# EAGLE schematic SMTParts_Digikey (EAGLE 9.5.1)
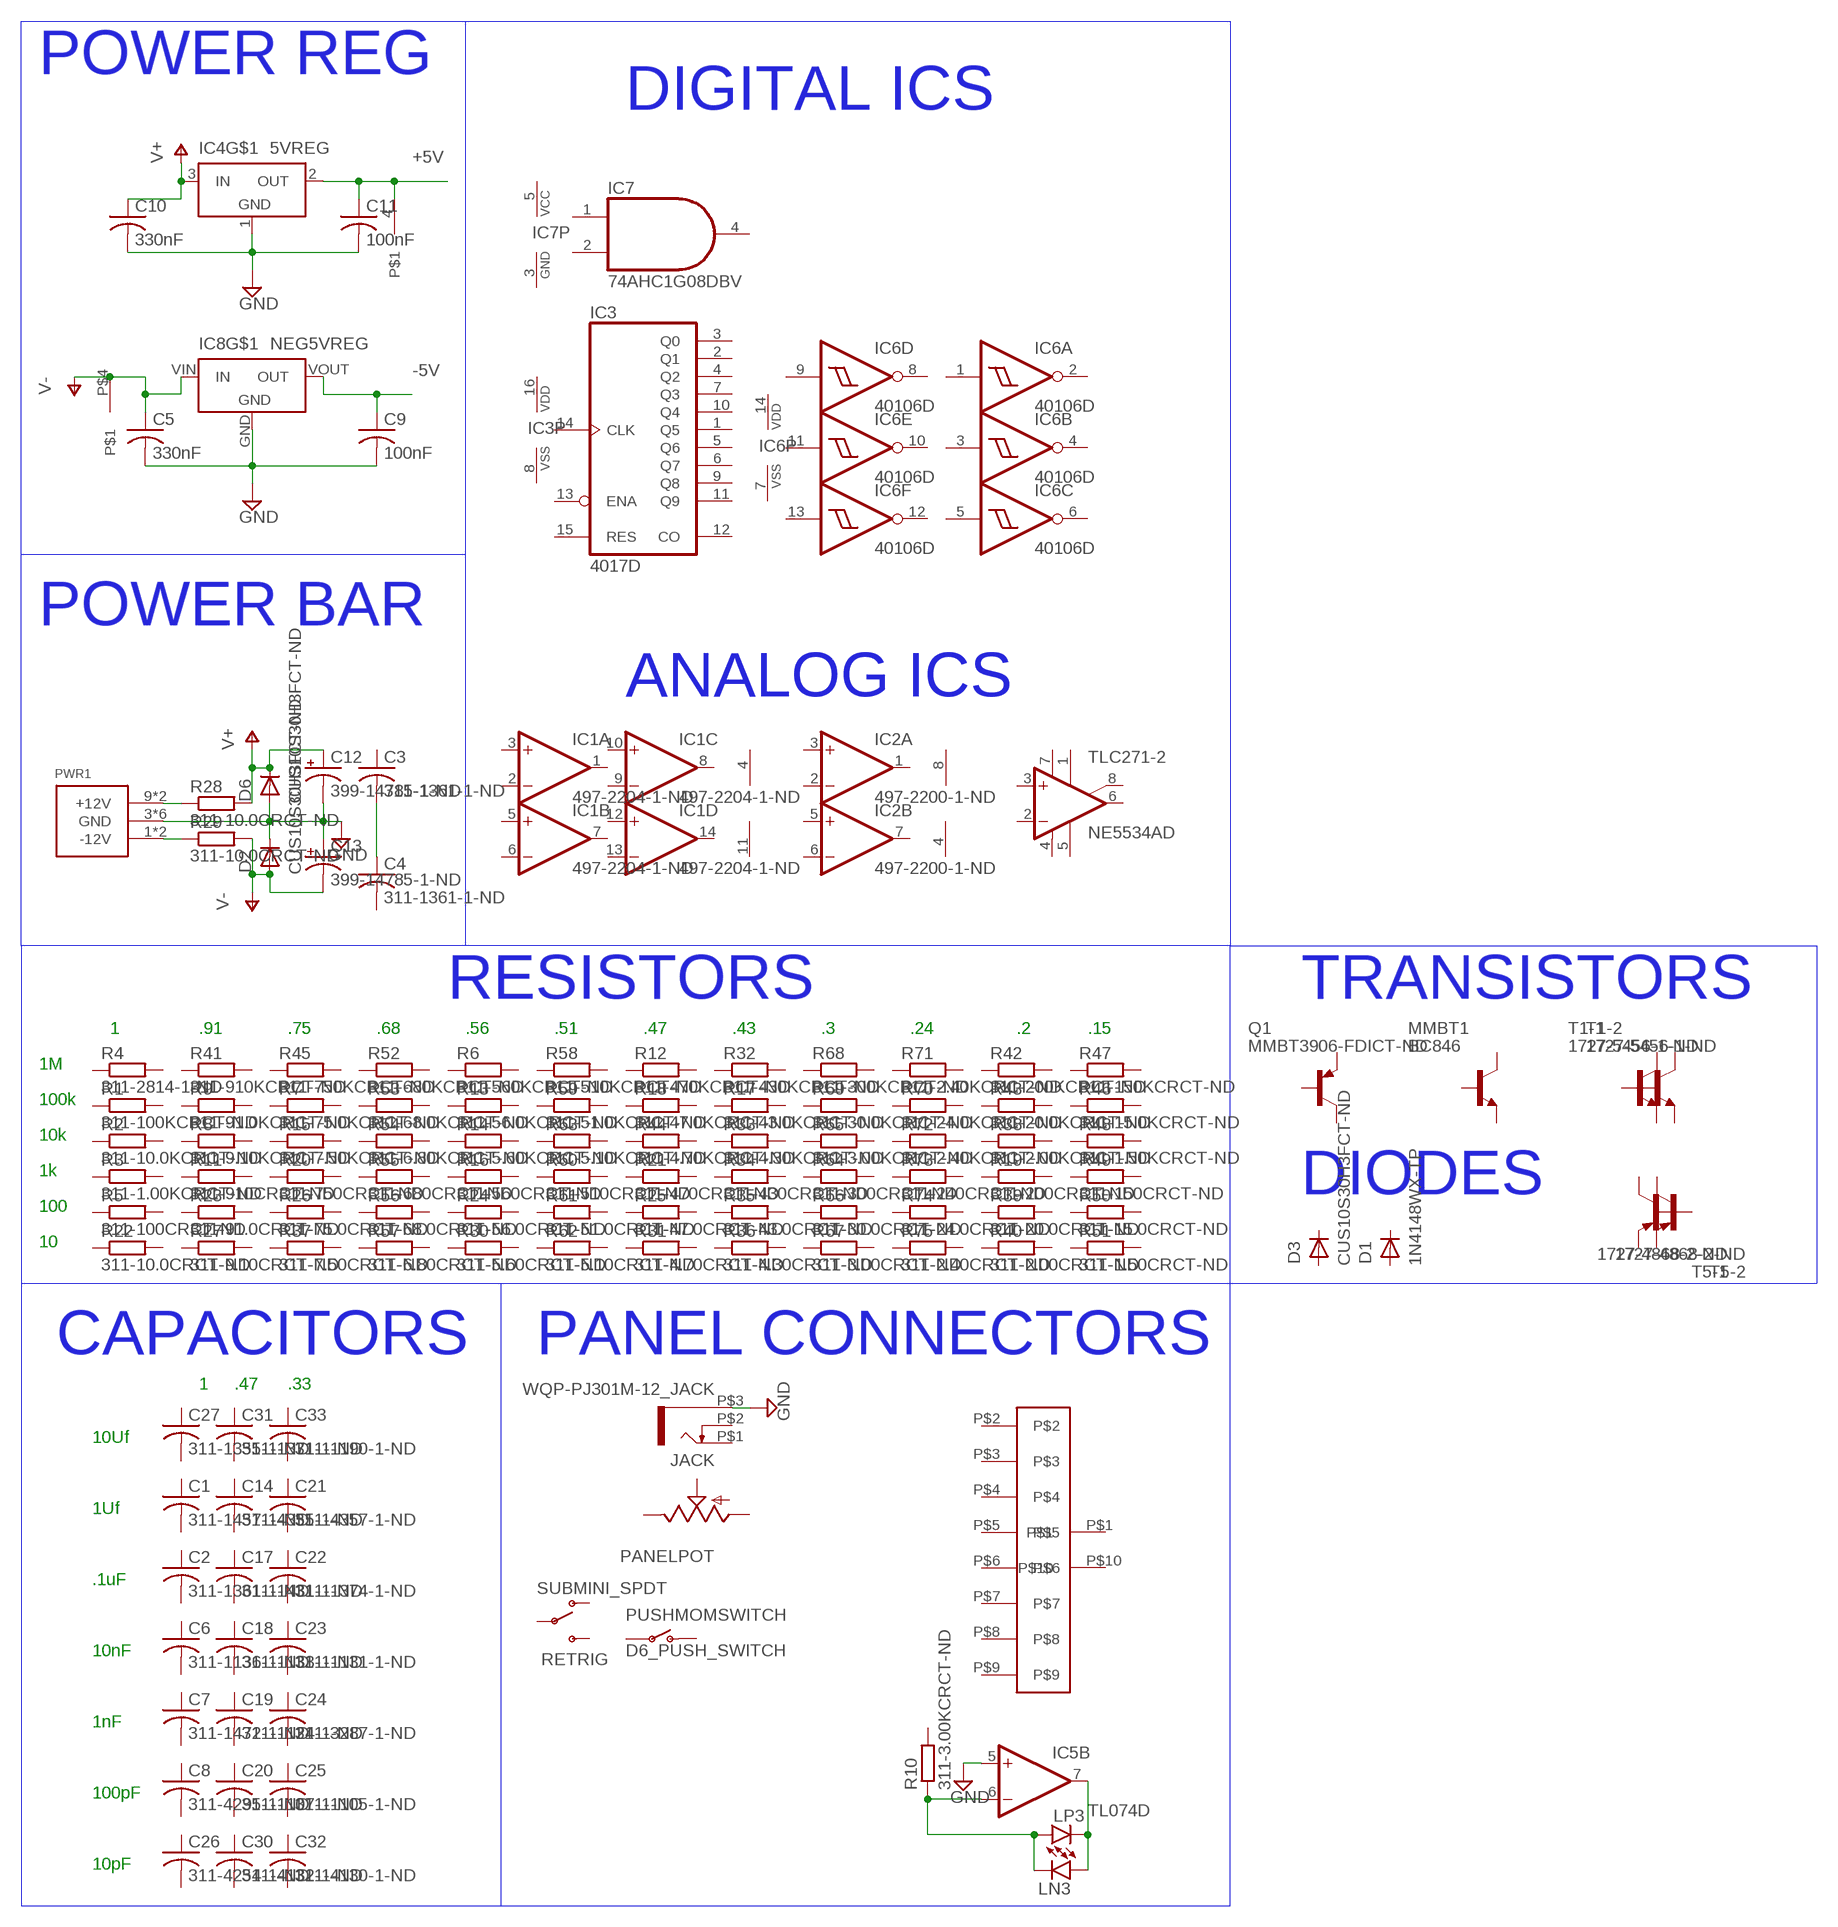
[diagram p0: schematic, sheet 1]

## Parts
C1  311-1457-1-ND  C-USC0805  [C0805]
C2  311-1361-1-ND  C-USC0805  [C0805]
C3  311-1361-1-ND  C-USC0805  [C0805]
C4  311-1361-1-ND  C-USC0805  [C0805]
C5  330nF  C-USC0805  [C0805]
C6  311-1136-1-ND  C-USC0805  [C0805]
C7  311-1472-1-ND  C-USC0805  [C0805]
C8  311-4295-1-ND  C-USC0805  [C0805]
C9  100nF  C-USC0805  [C0805]
C10  330nF  C-USC0805  [C0805]
C11  100nF  C-USC0805  [C0805]
C12  399-14785-1-ND  CPOL-USD  [PANASONIC_D]
C13  399-14785-1-ND  CPOL-USD  [PANASONIC_D]
C14  311-4355-1-ND  C-USC0805  [C0805]
C17  311-1431-1-ND  C-USC0805  [C0805]
C18  311-1133-1-ND  C-USC0805  [C0805]
C19  311-1124-1-ND  C-USC0805  [C0805]
C20  311-1107-1-ND  C-USC0805  [C0805]
C21  311-4357-1-ND  C-USC0805  [C0805]
C22  311-1374-1-ND  C-USC0805  [C0805]
C23  311-1131-1-ND  C-USC0805  [C0805]
C24  311-3287-1-ND  C-USC0805  [C0805]
C25  311-1105-1-ND  C-USC0805  [C0805]
C26  311-4254-1-ND  C-USC0805  [C0805]
C27  311-1355-1-ND  C-USC0805  [C0805]
C30  311-4132-1-ND  C-USC0805  [C0805]
C31  311-1371-1-ND  C-USC0805  [C0805]
C32  311-4130-1-ND  C-USC0805  [C0805]
C33  311-1190-1-ND  C-USC0805  [C0805]
D1  1N4148WX-TP  BAS321  [SOD323(F)]
D2  CUS10S30H3FCT-ND  BAS321  [SOD323(F)]
D3  CUS10S30H3FCT-ND  BAS321  [SOD323(F)]
D6  CUS10S30H3FCT-ND  BAS321  [SOD323(F)]
IC1  497-2204-1-ND  TL074D  [SO14]
IC2  497-2200-1-ND  TL072D  [SO08]
IC3  4017D  [SO16]
IC4  5VREG  5VREG-3.3  [SOT223]
IC5  TL074D  [SO14]
IC6  40106D  [SO14]
IC7  74AHC1G08DBV  [SOT23-5]
IC8  NEG5VREG  5VREG89SOT89  [SOT89]
JACK  WQP-PJ301M-12_JACK  [WQP-PJ301M-12_JACK]
LN3  LED3MM  [LED3MM]
LP3  LED3MM  [LED3MM]
MMBT1  BC846  [SOT23]
PANELPOT  9MM_SNAP-IN_POT_  [9MM_SNAP-IN_POT]
PUSHMOMSWITCH  D6_PUSH_SWITCH  [D6_BUTTON_RND]
PWR1  POWER_SIMPLE10  [POWER_10]
Q1  MMBT3906-FDICT-ND  MMBT3906LT1SMD  [SOT23-BEC]
R1  311-100KCRCT-ND  R-EU_M0805  [M0805]
R2  311-10.0KCRCT-ND  R-EU_M0805  [M0805]
R3  311-1.00KCRCT-ND  R-EU_M0805  [M0805]
R4  311-2814-1-ND  R-EU_M0805  [M0805]
R5  311-100CRCT-ND  R-EU_M0805  [M0805]
R6  311-560KCRCT-ND  R-EU_M0805  [M0805]
R7  311-75.0KCRCT-ND  R-EU_M0805  [M0805]
R8  311-9.10KCRCT-ND  R-EU_M0805  [M0805]
R9  311-91.0KCRCT-ND  R-EU_M0805  [M0805]
R10  311-3.00KCRCT-ND  R-EU_M0805  [M0805]
R11  311-910CRCT-ND  R-EU_M0805  [M0805]
R12  311-470KCRCT-ND  R-EU_M0805  [M0805]
R13  311-56.0KCRCT-ND  R-EU_M0805  [M0805]
R14  311-5.60KCRCT-ND  R-EU_M0805  [M0805]
R15  311-7.50KCRCT-ND  R-EU_M0805  [M0805]
R16  311-560CRCT-ND  R-EU_M0805  [M0805]
R17  311-43.0KCRCT-ND  R-EU_M0805  [M0805]
R18  311-47.0KCRCT-ND  R-EU_M0805  [M0805]
R19  311-200CRCT-ND  R-EU_M0805  [M0805]
R20  311-750CRCT-ND  R-EU_M0805  [M0805]
R21  311-470CRCT-ND  R-EU_M0805  [M0805]
R22  311-10.0CRCT-ND  R-EU_M0805  [M0805]
R23  311-91.0CRCT-ND  R-EU_M0805  [M0805]
R24  311-56.0CRCT-ND  R-EU_M0805  [M0805]
R25  311-47.0CRCT-ND  R-EU_M0805  [M0805]
R26  311-75.0CRCT-ND  R-EU_M0805  [M0805]
R27  311-9.10CRCT-ND  R-EU_M0805  [M0805]
R28  311-10.0CRCT-ND  R-EU_M0805  [M0805]
R29  311-10.0CRCT-ND  R-EU_M0805  [M0805]
R30  311-5.60CRCT-ND  R-EU_M0805  [M0805]
R31  311-4.70CRCT-ND  R-EU_M0805  [M0805]
R32  311-430KCRCT-ND  R-EU_M0805  [M0805]
R33  311-4.30KCRCT-ND  R-EU_M0805  [M0805]
R34  311-430CRCT-ND  R-EU_M0805  [M0805]
R35  311-43.0CRCT-ND  R-EU_M0805  [M0805]
R36  311-4.30CRCT-ND  R-EU_M0805  [M0805]
R37  311-7.50CRCT-ND  R-EU_M0805  [M0805]
R38  311-2.00KCRCT-ND  R-EU_M0805  [M0805]
R39  311-20.0CRCT-ND  R-EU_M0805  [M0805]
R40  311-2.00CRCT-ND  R-EU_M0805  [M0805]
R41  311-910KCRCT-ND  R-EU_M0805  [M0805]
R42  311-200KCRCT-ND  R-EU_M0805  [M0805]
R43  311-20.0KCRCT-ND  R-EU_M0805  [M0805]
R44  311-4.70KCRCT-ND  R-EU_M0805  [M0805]
R45  311-750KCRCT-ND  R-EU_M0805  [M0805]
R46  311-15.0KCRCT-ND  R-EU_M0805  [M0805]
R47  311-150KCRCT-ND  R-EU_M0805  [M0805]
R48  311-1.50KCRCT-ND  R-EU_M0805  [M0805]
R49  311-150CRCT-ND  R-EU_M0805  [M0805]
R50  311-15.0CRCT-ND  R-EU_M0805  [M0805]
R51  311-1.50CRCT-ND  R-EU_M0805  [M0805]
R52  311-680KCRCT-ND  R-EU_M0805  [M0805]
R53  311-68.0KCRCT-ND  R-EU_M0805  [M0805]
R54  311-6.80KCRCT-ND  R-EU_M0805  [M0805]
R55  311-680CRCT-ND  R-EU_M0805  [M0805]
R56  311-68.0CRCT-ND  R-EU_M0805  [M0805]
R57  311-6.80CRCT-ND  R-EU_M0805  [M0805]
R58  311-510KCRCT-ND  R-EU_M0805  [M0805]
R59  311-51.0KCRCT-ND  R-EU_M0805  [M0805]
R60  311-510CRCT-ND  R-EU_M0805  [M0805]
R61  311-51.0CRCT-ND  R-EU_M0805  [M0805]
R62  311-5.10CRCT-ND  R-EU_M0805  [M0805]
R63  311-5.10KCRCT-ND  R-EU_M0805  [M0805]
R64  311-300CRCT-ND  R-EU_M0805  [M0805]
R65  311-3.00KCRCT-ND  R-EU_M0805  [M0805]
R66  311-30.0CRCT-ND  R-EU_M0805  [M0805]
R67  311-3.00CRCT-ND  R-EU_M0805  [M0805]
R68  311-300KCRCT-ND  R-EU_M0805  [M0805]
R69  311-30.0KCRCT-ND  R-EU_M0805  [M0805]
R70  311-24.0KCRCT-ND  R-EU_M0805  [M0805]
R71  311-2.40KCRCT-ND  R-EU_M0805  [M0805]
R72  311-2.40KCRCT-ND  R-EU_M0805  [M0805]
R73  311-240CRCT-ND  R-EU_M0805  [M0805]
R74  311-24.0CRCT-ND  R-EU_M0805  [M0805]
R75  311-2.40CRCT-ND  R-EU_M0805  [M0805]
RETRIG  SUBMINI_SPDT  [SUBMINI_TOGGLE]
T1  1727-5456-1-ND  BC847BS  [SOT363]
T5  1727-4868-2-ND  BC857BS  [SOT363]
TLC271-2  NE5534AD  [SO08]
U$1  8ROTSW  [8ROTARY]

## Nets
1: C3.2 C4.1
+5V: C11.1 IC4.2(OUT) IC4.4
-5V: C9.1 IC8.VOUT(OUT)
GND: C5.2 C9.2 C10.2 C11.2 C12.- C13.+ D2.1(K) D6.2(A) IC4.1(GND) IC5.5(B:+IN) IC8.GND JACK.P$3 PWR1.3(GND) PWR1.4(GND) PWR1.5(GND) PWR1.6(GND) PWR1.7(GND) PWR1.8(GND)
N$10: IC5.6(B:-IN) LN3.K(C) LP3.A R10.1
N$22: IC5.7(B:OUT) LN3.A LP3.K(C)
N$32: PWR1.9(+12V) PWR1.10(+12V) R28.1
N$33: PWR1.1(-12V) PWR1.2(-12V) R29.1
V+ [New]: C10.1 C12.+ D6.1(K) IC4.3(IN) R28.2
V-: C5.1 C13.- D2.2(A) IC8.P$4 IC8.VIN(IN) R29.2
Unconnected: C1.1 C1.2 C2.1 C2.2 C3.1 C4.2 C6.1 C6.2 C7.1 C7.2 C8.1 C8.2 C14.1 C14.2 C17.1 C17.2 C18.1 C18.2 C19.1 C19.2 C20.1 C20.2 C21.1 C21.2 C22.1 C22.2 C23.1 C23.2 C24.1 C24.2 C25.1 C25.2 C26.1 C26.2 C27.1 C27.2 C30.1 C30.2 C31.1 C31.2 C32.1 C32.2 C33.1 C33.2 D1.1(K) D1.2(A) D3.1(K) D3.2(A) IC1.1(A:OUT) IC1.2(A:-IN) IC1.3(A:+IN) IC1.5(B:+IN) IC1.6(B:-IN) IC1.7(B:OUT) IC1.8(C:OUT) IC1.9(C:-IN) IC1.10(C:+IN) IC1.12(D:+IN) IC1.13(D:-IN) IC1.14(D:OUT) IC2.1(A:OUT) IC2.2(A:-IN) IC2.3(A:+IN) IC2.5(B:+IN) IC2.6(B:-IN) IC2.7(B:OUT) IC3.1(Q5) IC3.2(Q1) IC3.3(Q0) IC3.4(Q2) IC3.5(Q6) IC3.6(Q7) IC3.7(Q3) IC3.9(Q8) IC3.10(Q4) IC3.11(Q9) IC3.12(CO) IC3.13(ENA) IC3.14(CLK) IC3.15(RES) IC5.1(A:OUT) IC5.2(A:-IN) IC5.3(A:+IN) IC5.8(C:OUT) IC5.9(C:-IN) IC5.10(C:+IN) IC5.12(D:+IN) IC5.13(D:-IN) IC5.14(D:OUT) IC6.1(A:I) IC6.2(A:O) IC6.3(B:I) IC6.4(B:O) IC6.5(C:I) IC6.6(C:O) IC6.8(D:O) IC6.9(D:I) IC6.10(E:O) IC6.11(E:I) IC6.12(F:O) IC6.13(F:I) IC7.1(I0) IC7.2(I1) IC7.4(O) JACK.P$1 JACK.P$2 MMBT1.1(B) MMBT1.2(E) MMBT1.3(C) PANELPOT.1(A) PANELPOT.2(S) PANELPOT.3(E) PUSHMOMSWITCH.P$1(O) PUSHMOMSWITCH.P$2(O) PUSHMOMSWITCH.P$3(P) PUSHMOMSWITCH.P$4(P) Q1.B Q1.C Q1.E R1.1 R1.2 R2.1 R2.2 R3.1 R3.2 R4.1 R4.2 R5.1 R5.2 R6.1 R6.2 R7.1 R7.2 R8.1 R8.2 R9.1 R9.2 R10.2 R11.1 R11.2 R12.1 R12.2 R13.1 R13.2 R14.1 R14.2 R15.1 R15.2 R16.1 R16.2 R17.1 R17.2 R18.1 R18.2 R19.1 R19.2 R20.1 R20.2 R21.1 R21.2 R22.1 R22.2 R23.1 R23.2 R24.1 R24.2 R25.1 R25.2 R26.1 R26.2 R27.1 R27.2 R30.1 R30.2 R31.1 R31.2 R32.1 R32.2 R33.1 R33.2 R34.1 R34.2 R35.1 R35.2 R36.1 R36.2 R37.1 R37.2 R38.1 R38.2 R39.1 R39.2 R40.1 R40.2 R41.1 R41.2 R42.1 R42.2 R43.1 R43.2 R44.1 R44.2 R45.1 R45.2 R46.1 R46.2 R47.1 R47.2 R48.1 R48.2 R49.1 R49.2 R50.1 R50.2 R51.1 R51.2 R52.1 R52.2 R53.1 R53.2 R54.1 R54.2 R55.1 R55.2 R56.1 R56.2 R57.1 R57.2 R58.1 R58.2 R59.1 R59.2 R60.1 R60.2 R61.1 R61.2 R62.1 R62.2 R63.1 R63.2 R64.1 R64.2 R65.1 R65.2 R66.1 R66.2 R67.1 R67.2 R68.1 R68.2 R69.1 R69.2 R70.1 R70.2 R71.1 R71.2 R72.1 R72.2 R73.1 R73.2 R74.1 R74.2 R75.1 R75.2 RETRIG.1(O) RETRIG.3(S) RETRIG.COM(COMMON) T1.1(-1:E) T1.2(-1:B) T1.3(-2:C) T1.4(-2:E) T1.5(-2:B) T1.6(-1:C) T5.1(-1:E) T5.2(-1:B) T5.3(-2:C) T5.4(-2:E) T5.5(-2:B) T5.6(-1:C) TLC271-2.1(ON) TLC271-2.2(-IN) TLC271-2.3(+IN) TLC271-2.5(CMP) TLC271-2.6(OUT) TLC271-2.8(ON/CMP) U$1.P$1 U$1.P$2 U$1.P$3 U$1.P$4 U$1.P$5 U$1.P$6 U$1.P$7 U$1.P$8 U$1.P$9 U$1.P$10

## Notes on the sheet
- POWER REG
- DIGITAL ICS
- POWER BAR
- ANALOG ICS
- RESISTORS | TRANSISTORS
- 1 | .91 | .75 | .68 | .56 | .51 | .47 | .43 | .3 | .24 | .2 | .15
- 1M
- 100k
- 10k
- 1k
- DIODES
- 100
- 10
- CAPACITORS | PANEL CONNECTORS
- 1 | .47 | .33
- 10Uf
- 1Uf
- .1uF
- 10nF
- 1nF
- 100pF
- 10pF

## Power pins joined to a net without a drawn wire
GND: IC7.3(GND)
V+: IC1.4(P:V+) IC2.8(P:V+) IC5.4(P:V+) TLC271-2.7(V+)
V-: IC1.11(P:V-) IC2.4(P:V-) IC5.11(P:V-) TLC271-2.4(V-)
VCC: IC7.5(VCC)
VDD: IC3.16(VDD) IC6.14(P:VDD)
VSS: IC3.8(VSS) IC6.7(P:VSS)

## Library data of the parts
C1-C11 C14 C17-C27 C30-C33 = rcl:C-US: CAPACITOR, American symbol; SPICEPREFIX: C
C12 C13 = rcl:CPOL-US: POLARIZED CAPACITOR, American symbol
D1-D3 D6 = nxp_60_1_1:BAS321: General purpose diode The BAS321 is a general purpose diode fabricated in planar technology and encapsulated in a plastic SOD323 package. AAL Eindhoven MK
IC1 IC5 = linear:TL074: OP AMP
IC2 = linear:TL072: OP AMP
IC3 = 40xx:4017: COUNTER/DIVIDER
IC4 = 5vReg:5VREG: 1.5A, Low Noise, Fast Transient Response LDO Regulator Source: http://www.linear.com/pc/downloadDocument.do?navId=H0,C3,P2222,D3148; MPN: LT1963EST-3.3; OC_FARNELL: 1501032; OC_NEWARK: 57M7546
IC6 = 40xx:40106: Hex SCHMITT TRIGGER
IC7 = 74xx-little-us:74*1G08: 2-input AND gate
IC8 = 5vReg:5VREG89: 1.5A, Low Noise, Fast Transient Response LDO Regulator Source: http://www.linear.com/pc/downloadDocument.do?navId=H0,C3,P2222,D3148
JACK = thonkiconn:WQP-PJ301M-12_JACK
LN3 LP3 = led:LED: LED OSRAM: - CHIPLED LG R971, LG N971, LY N971, LG Q971, LY Q971, LO R971, LY R971 LH N974, LH R974 LS Q976, LO Q976, LY Q976 LO Q996 - Hyper CHIPLED LW Q18S LB Q993, LB Q99A, LB R99A - SideLED LS A670, LO A670, LY A670, LG A670, LP A670 LB A673, LV A673, LT A673, LW A673 LH A674 LY A675 LS A676, LA A676, LO A676, LY A676, LW A676 LS A679, LY A679, LG A679 - Hyper Micro SIDELED® LS Y876, LA Y876, LO Y876, LY Y876 LT Y87S - SmartLED LW L88C, LW L88S LB L89C, LB L89S, LG L890 LS L89K, LO L89K, LY L89K LS L896, LA L896, LO L896, LY L896 - TOPLED LS T670, LO T670, LY T670, LG T670, LP T670 LSG T670, LSP T670, LSY T670, LOP T670, LYG T670 LG T671, LOG T671, LSG T671 LB T673, LV T673, LT T673, LW T673 LH T674 LS T676, LA T676, LO T676, LY T676, LB T676, LH T676, LSB T676, LW T676 LB T67C, LV T67C, LT T67C, LS T67K, LO T67K, LY T67K, LW E67C LS E67B, LA E67B, LO E67B, LY E67B, LB E67C, LV E67C, LT E67C LW T67C LS T679, LY T679, LG T679 LS T770, LO T770, LY T770, LG T770, LP T770 LB T773, LV T773, LT T773, LW T773 LH T774 LS E675, LA E675, LY E675, LS T675 LS T776, LA T776, LO T776, LY T776, LB T776 LHGB T686 LT T68C, LB T68C - Hyper Mini TOPLED® LB M676 - Mini TOPLED Santana® LG M470 LS M47K, LO M47K, LY M47K Source: http://www.osram.convergy.de LUXEON: - LUMILED® LXK2-PW12-R00, LXK2-PW12-S00, LXK2-PW14-U00, LXK2-PW14-V00 LXK2-PM12-R00, LXK2-PM12-S00, LXK2-PM14-U00 LXK2-PE12-Q00, LXK2-PE12-R00, LXK2-PE12-S00, LXK2-PE14-T00, LXK2-PE14-U00 LXK2-PB12-K00, LXK2-PB12-L00, LXK2-PB12-M00, LXK2-PB14-N00, LXK2-PB14-P00, LXK2-PB14-Q00 LXK2-PR12-L00, LXK2-PR12-M00, LXK2-PR14-Q00, LXK2-PR14-R00 LXK2-PD12-Q00, LXK2-PD12-R00, LXK2-PD12-S00 LXK2-PH12-R00, LXK2-PH12-S00 LXK2-PL12-P00, LXK2-PL12-Q00, LXK2-PL12-R00 Source: www.luxeon.com KINGBRIGHT: KA-3528ASYC Source: www.kingbright.com
MMBT1 = transistor:BC846: NPN TRANSISTOR
PANELPOT = MusicThingModular:9MM_SNAP-IN_POT: 9mm vertical snap-in pot, Alpha / Panasonic style
PUSHMOMSWITCH = TomW:D6_PUSH_SWITCH
PWR1 = eurorack:POWER_SIMPLE; OC_NEWARK: unknown
Q1 = transistor-pnp:MMBT3906*: PNP Transistror
R1-R75 = resistor:R-EU_: RESISTOR, European symbol
RETRIG = MusicThingModular:SUBMINI_SPDT
T1 = nxp_60_1_1:BC847BS: NPN/NPN general-purpose transistor pair in a very small SOT363 (SC-88) Surface-Mounted Device (SMD) plastic package. AAL Eindhoven MK
T5 = nxp_60_1_1:BC857BS: PNP double transistor in an SC-88; SOT363 plastic package. AAL Eindhoven MK
TLC271-2 = linear:NE5534: LOW-NOISE OPERATIONAL AMPLIFIER Source: http://focus.ti.com/lit/ds/symlink/ne5534.pdf
U$1 = 8RotSW:8ROTSW

## Net classes
0 default: width 0.012 mm, clearance 0.1 mm
1 New: width 0.012 mm, clearance 0.1 mm